# Altium project rpi_adapter_mipi_in_out.PrjPcb
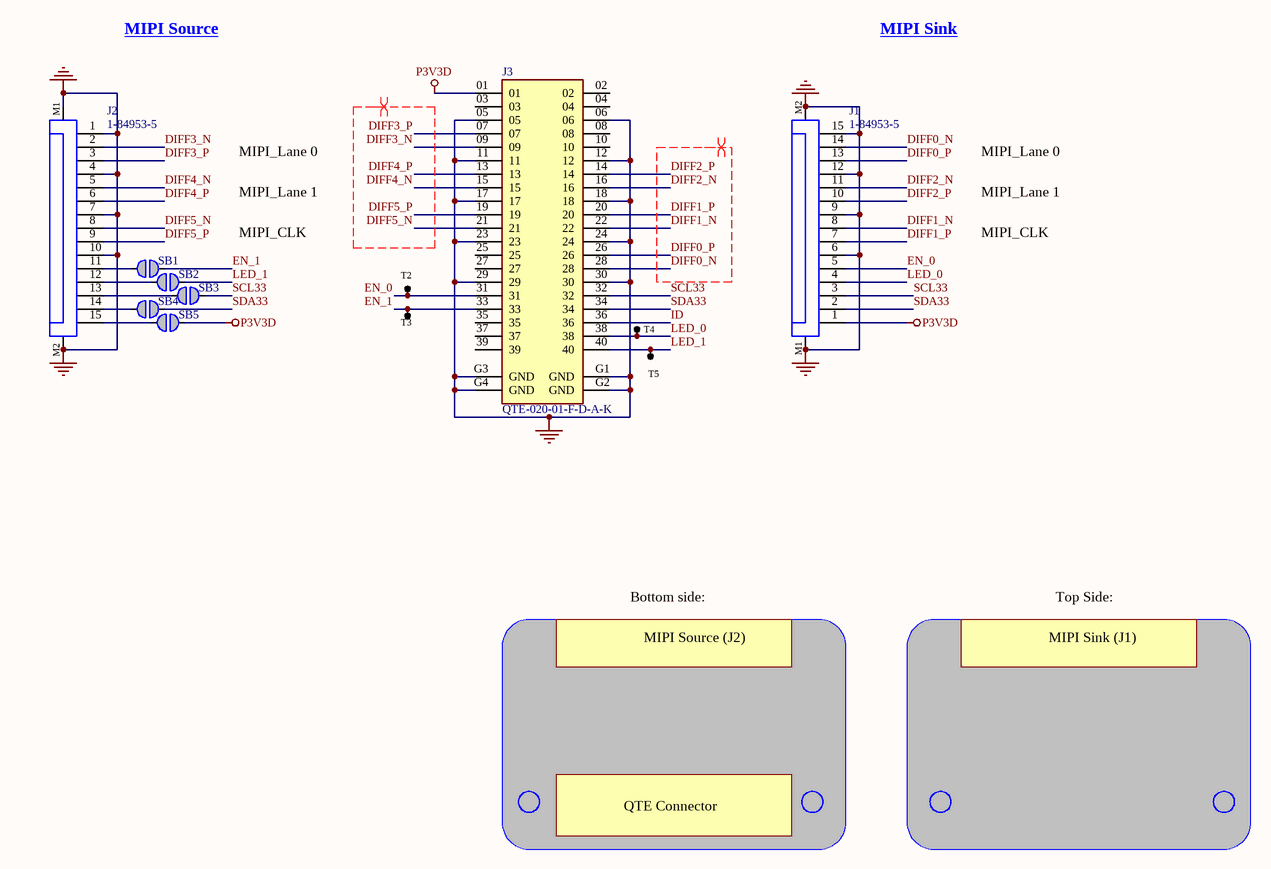
[diagram p0: rpi_adapter_mipi_in_out.SchDoc]
SCH_NAME: tinyDualRPi Adapter MIPI_IN_OUT; REV: v2.0; PCB_NAME: tinyDualRPi Adapter MIPI_IN_OUT
1 sheet, 12 parts. Net scope: global (net labels, ports and power ports of the same name join across sheets).
Board file: rpi_adapter_mipi_in_out.PcbDoc

## Sheet rpi_adapter_mipi_in_out.SchDoc
size B; SheetNumber: 1; SheetTotal: 1

### Parts
J1  1-84953-5  [TE_1-84953-5]
J2  1-84953-5  [TE_1-84953-5]
J3  QTE-020-01-F-D-A-K  [SAMTEC_QTE-020-01-X-D-A]
SB1  Solderbridge  [Solderbridge]  (value not drawn)  (no BOM)
SB2  Solderbridge  [Solderbridge]  (value not drawn)  (no BOM)
SB3  Solderbridge  [Solderbridge]  (value not drawn)  (no BOM)
SB4  Solderbridge  [Solderbridge]  (value not drawn)  (no BOM)
SB5  Solderbridge  [Solderbridge]  (value not drawn)  (no BOM)
T2  TP_S  [TP 1mm]  (value not drawn)  (no BOM)
T3  TP_S  [TP 1mm]  (value not drawn)  (no BOM)
T4  TP_S  [TP 1mm]  (value not drawn)  (no BOM)
T5  TP_S  [TP 1mm]  (value not drawn)  (no BOM)

### Nets
GND: J1.6 J1.9 J1.12 J1.15 J1.M1 J1.M2 J2.1 J2.4 J2.7 J2.10 J2.M1 J2.M2 J3.05 J3.06 J3.11 J3.12 J3.17 J3.18 J3.23 J3.24 J3.29 J3.30 J3.G1(GND) J3.G2(GND) J3.G3(GND) J3.G4(GND)
P3V3D: J1.1 J3.01 SB5.1
DIFF0_N: J1.14 J3.28
DIFF0_P: J1.13 J3.26
DIFF1_N: J1.8 J3.22
DIFF1_P: J1.7 J3.20
DIFF2_N: J1.11 J3.16
DIFF2_P: J1.10 J3.14
DIFF3_N: J2.2 J3.09
DIFF3_P: J2.3 J3.07
DIFF4_N: J2.5 J3.15
DIFF4_P: J2.6 J3.13
DIFF5_N: J2.8 J3.21
DIFF5_P: J2.9 J3.19
EN_0: J1.5 J3.31 T2.1
EN_1: J3.33 SB1.1 T3.1
ID: J3.36
LED_0: J1.4 J3.38 T4.1
LED_1: J3.40 SB2.1 T5.1
SCL33: J1.3 J3.32 SB3.1
SDA33: J1.2 J3.34 SB4.1
NetJ2_11: J2.11 SB1.2
NetJ2_12: J2.12 SB2.2
NetJ2_13: J2.13 SB3.2
NetJ2_14: J2.14 SB4.2
NetJ2_15: J2.15 SB5.2

Not connected (* = marked no-connect by the designer): J3 02 03 04 08 10 25 27 35 37 39

### Layout directives
differential pair: DIFF0_N, DIFF0_P, DIFF1_N, DIFF1_P, DIFF2_N, DIFF2_P, DIFF3_N, DIFF3_P, DIFF4_N, DIFF4_P, DIFF5_N, DIFF5_P

### Notes on the sheet
- MIPI Source
- MIPI Sink
- MIPI_Lane 0
- MIPI_CLK
- MIPI_Lane 1
- Bottom side:
- MIPI Source (J2)
- MIPI Sink (J1)
- Top Side:
- QTE Connector

### Library data of the parts
J1 J2 = FPC - 15P - 2MP: Conn FPC Connector SKT 15 POS 1mm Solder RA SMD T/R; Manufacturer: TE Connectivity; Actuator Material: Nylon,Glass,Polyamide; Actuator Color: Black; Voltage Rating: 200V; Number of Contacts: 15; Current Rating: 1A; Gender: Receptacle; Wire/Cable Type: Flat Flex; Shielding: Unshielded; Connector Type: Receptacle,Connector,Socket; Connector System: Flex-to-Board; Mating Alignment: Yes (With); PCB Mount Alignment: No (Without); PCB Mount Retention: With; Contact Location: Top; PCB Mounting Orientation: Right Angle; Pitch: 0.039inch; Plating Thickness: 2um; Supplier 1: Digi-Key; Supplier Part Number 1: A101405CT-ND; Manufacturer Part Number: 1-84953-5; RoHS: Yes; Category: FFC / FPC; Stock 1: 9836; Pricing 1: 1=1.02000, 10=0.97700, 25=0.93400, 50=0.92100, 100=0.80470, 250=0.77460, 500=0.73158 (USD); Mount: Surface Mount; Contact Plating: Tin,Bright; Contact Material: Bronze; Housing Color: Natural; Housing Material: Polymer; Min Operating Temperature: -40°C; Max Operating Temperature: 85°C; Termination: SMD/SMT; Packaging: Tape and Reel; Number of Rows: 1; Package Quantity: 1200; Orientation: Right Angle; Series: FPC; Number of Positions: 15; Sealable: No (Without); Shrouded: Yes (With); Contact Current Rating: 1A; Max Voltage Rating (AC): 200V; Length: 22.92mm; Width: 0.2575inch; Height: 2.56mm; Depth: 7.3mm; Radiation Hardening: No; RoHS Compliant: Yes; Flammability Rating: UL94 V-0; ELV: Compliant; ComponentLink1URL: https://datasheet.ciiva.com/669/eng-cd-84953-a3-669110.pdf?src-supplier=Digi-Key; ComponentLink1Description: https://datasheet.ciiva.com/669/eng-cd-84953-a3-669110.pdf?src-supplier=Digi-Key; ComponentLink2URL: https://datasheet.ciiva.com/669/eng-cd-84953-a3-669111.pdf?src-supplier=Digi-Key; ComponentLink2Description: https://datasheet.ciiva.com/669/eng-cd-84953-a3-669111.pdf?src-supplier=Digi-Key; ComponentLink3URL: https://datasheet.ciiva.com/669/eng-cd-84953-a3-669112.pdf?src-supplier=Digi-Key; ComponentLink3Description: https://datasheet.ciiva.com/669/eng-cd-84953-a3-669112.pdf?src-supplier=Digi-Key
J3 = QSE-020-01-F-D-A-K: Q Strip® High-Speed Ground Plane Header, 0.80mm Pitch; Manufacturer: Samtec; Number of Positions: 40; Gender: Male; Pitch: 0.031inch; Mated Stacking Heights: 5mm; Supplier 1: Digi-Key; Supplier Part Number 1: SAM8846-ND; Manufacturer Part Number: QTE-020-01-F-D-A; RoHS: Yes; Category: Board to Board Connectors; Stock: 179; Pricing: 1=5.61000, 10=5.09400, 25=4.82480, 40=4.71275, 80=4.48825, 230=3.92726, 440=3.81505, 945=3.25402, 2400=3.02960 (USD); Mounting Technology: Surface Mount; Contact Plating: Gold; Number of Rows: 2; Packaging: Tray; Termination: Solder; Number of Contacts: 40; Series: QStrip® QTE; Package Quantity: 1; RoHS Compliant: Yes; ComponentLink1URL: https://datasheet.ciiva.com/6924/qte-xxx-xx-x-d-xxx-mkt-6924765.pdf?src-supplier=Digi-Key; ComponentLink1Description: https://datasheet.ciiva.com/6924/qte-xxx-xx-x-d-xxx-mkt-6924765.pdf?src-supplier=Digi-Key
SB1-SB5 = Solderbridge: Artikkelnr Noca: N.A.; Part Number: Solderbridge; Manufacturer: *; Manufacturer Part Number: *; Datasheet: *; LatestRevisionDate: 2009-12-14; Pin Count: 2; Publisher: Nordic Semiconductor; Published: 2009-12-14; Value: Solderbridge; Note: *; Supplier: *; Supplier part number: *; 2nd source Supplier: *; 2nd source part number: *; Footprint Doc: Solderbridge; Artikkelnr Simpro: N.A.
T2-T5 = TP_S: test point

## Assembly variants
v2.0: all parts fitted